# EAGLE design rapidshark-lipo-sensor-mk-3.2 (EAGLE 7.5.0)
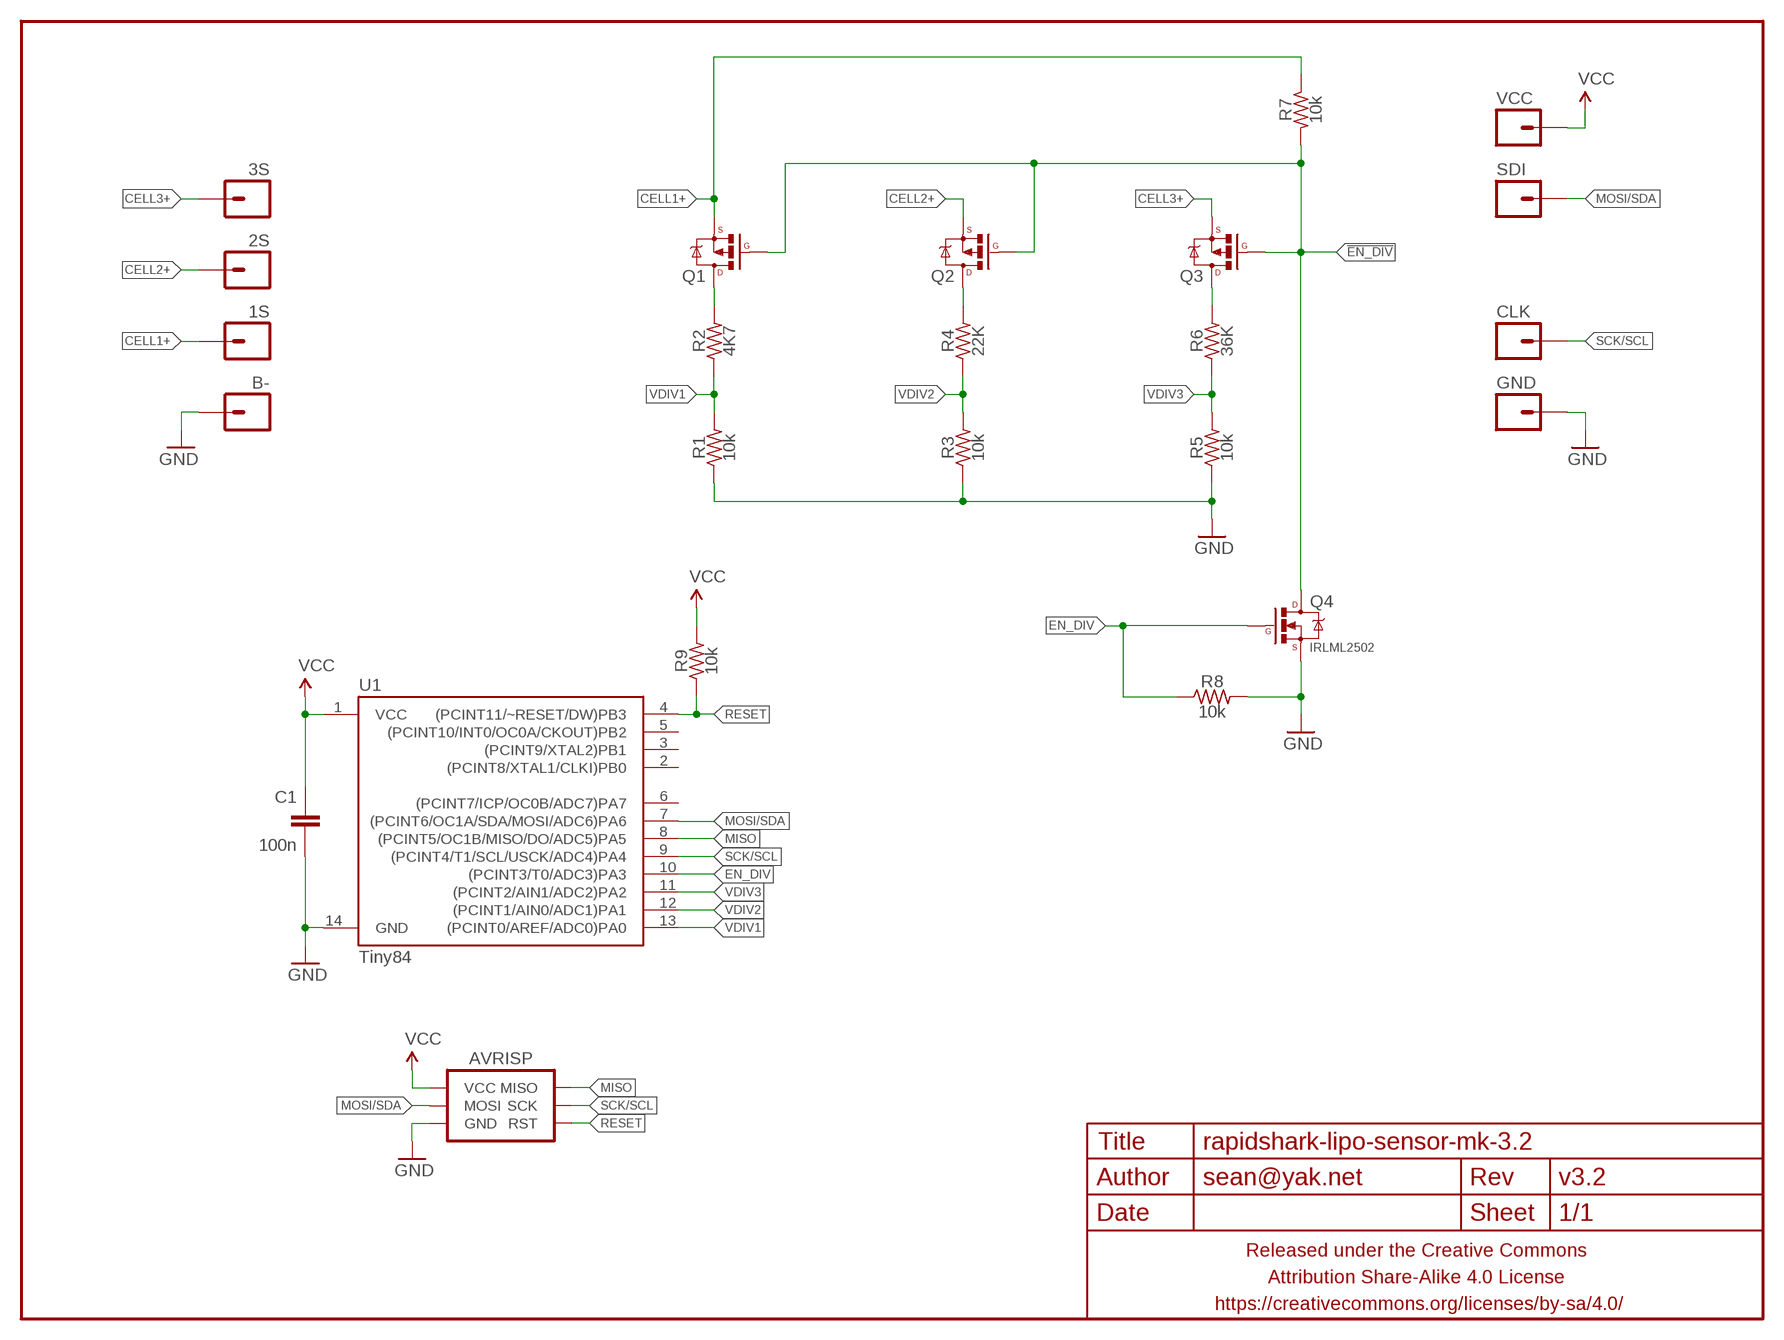
[diagram p0: schematic, sheet 1]

## Parts
1S  M01PTH-0.9MM  [1X01-0.9MM]
2S  M01PTH-0.9MM  [1X01-0.9MM]
3S  M01PTH-0.9MM  [1X01-0.9MM]
AVRISP  AVR_SPI_PRG_6SMD_TEST_POINTS  [2X3_SMD_TEST_POINTS]
B-  M01PTH-0.9MM  [1X01-0.9MM]
C1  100n  CAPACITOR-CERAMICC0603-TIGHTER  [C0603-TIGHTER]
CLK  M01PTH-0.9MM  [1X01-0.9MM]
FRAME1  FRAME-LETTERNO_PACKAGE  [DUMMY]
GND  M01PTH-0.9MM  [1X01-0.9MM]
Q1  MOSFET-PCHANNELSOT-23  [SOT23]
Q2  MOSFET-PCHANNELSOT-23  [SOT23]
Q3  MOSFET-PCHANNELSOT-23  [SOT23]
Q4  IRLML2502  MOSFET-NCHANNELIRLML2502  [SOT23]
R1  10k  RESISTORR0603-TIGHTER  [R0603-TIGHTER]
R2  4K7  RESISTORR0603-TIGHTER  [R0603-TIGHTER]
R3  10k  RESISTORR0603-TIGHTER  [R0603-TIGHTER]
R4  22K  RESISTORR0603-TIGHTER  [R0603-TIGHTER]
R5  10k  RESISTORR0603-TIGHTER  [R0603-TIGHTER]
R6  36K  RESISTORR0603-TIGHTER  [R0603-TIGHTER]
R7  10k  RESISTORR0603-TIGHTER  [R0603-TIGHTER]
R8  10k  RESISTORR0603-TIGHTER  [R0603-TIGHTER]
R9  10k  RESISTORR0603-TIGHTER  [R0603-TIGHTER]
SDI  M01PTH-0.9MM  [1X01-0.9MM]
U1  Tiny84  ATTINY84  [SO14]
VCC  M01PTH-0.9MM  [1X01-0.9MM]

## Nets
!EN_DIV: Q1.1(G) Q2.1(G) Q3.1(G) Q4.3(D) R7.2
CELL1+: 1S.1 Q1.2(S) R7.1
CELL2+: 2S.1 Q2.2(S)
CELL3+: 3S.1 Q3.2(S)
EN_DIV: Q4.1(G) R8.1 U1.10((PCINT3/T0/ADC3)PA3)
GND: AVRISP.6(GND) B-.1 C1.2 GND.1 Q4.2(S) R1.1 R3.1 R5.1 R8.2 U1.14(GND)
MISO: AVRISP.1(MISO) U1.8((PCINT5/OC1B/MISO/DO/ADC5)PA5)
MOSI/SDA: AVRISP.4(MOSI) SDI.1 U1.7((PCINT6/OC1A/SDA/MOSI/ADC6)PA6)
N$2: Q2.3(D) R4.2
N$3: Q3.3(D) R6.2
N$6: Q1.3(D) R2.2
RESET: AVRISP.5(RST) R9.1 U1.4((PCINT11/~RESET/DW)PB3)
SCK/SCL: AVRISP.3(SCK) CLK.1 U1.9((PCINT4/T1/SCL/USCK/ADC4)PA4)
VCC: AVRISP.2(VCC) C1.1 R9.2 U1.1(VCC) VCC.1
VDIV1: R1.2 R2.1 U1.13((PCINT0/AREF/ADC0)PA0)
VDIV2: R3.2 R4.1 U1.12((PCINT1/AIN0/ADC1)PA1)
VDIV3: R5.2 R6.1 U1.11((PCINT2/AIN1/ADC2)PA2)
Unconnected: U1.2((PCINT8/XTAL1/CLKI)PB0) U1.3((PCINT9/XTAL2)PB1) U1.5((PCINT10/INT0/OC0A/CKOUT)PB2) U1.6((PCINT7/ICP/OC0B/ADC7)PA7)

## Library data of the parts
1S 2S 3S B- CLK GND SDI VCC = a_parts:M01: Header 1 Standard 1-pin 0.1" header. Use with straight break away headers (SKU : PRT-00116), right angle break away headers (PRT-00553), swiss pins (PRT-00743), machine pins (PRT-00117), and female headers (PRT-00115).
AVRISP = A_butts:AVR_SPI_PRG_6: AVR ISP 6 Pin This is the reduced ISP connector for AVR programming. Common on Arduino. This footprint will take up less PCB space and can be used with a 10-pin to 6-pin adapter such as SKU: BOB-08508 **Special note about "TEST_POINT" package. The stop mask is on the top side, so if you want your programming test points to be on the bottom of your board, make sure to place this package on the bottom side of the board. This also ensure that the orientation to program from the bottom side will be correct.
C1 = a_parts:CAPACITOR-CERAMIC: CAPACITOR, European symbol
FRAME1 = A_butts:FRAME-LETTER: Schematic Frame Standard 8.5x11 US Letter frame; DESIGNER: sean@yak.net; VERSION: v3.2
Q1-Q3 = a_parts:MOSFET-PCHANNEL: Generic PMOSFET IRLML2244 - TRANS-11153 (SOT-23 -20V -4.3A) (1.Gate 2.Source 3.Drain) FQP27P06 - COM-10349 <http://www.sparkfun.com/products/10349> (TO-220 -60V -27A) (1.Gate 2.Source 3.Drain)
Q4 = a_parts:MOSFET-NCHANNEL: Common NMOSFET Parts MFG P/N Store ID Prod ID FDD8780 TRANS-09984 SI7820DN TRANS-11055 FDS6630A IC-08089 2N7002PW TRANS-11151 FQP30N06L COM-10213 TRANS-10060 BSS123LT1G TRANS-08345 BSS138 TRANS-00830 BS170 2N7000
R1-R9 = a_parts:RESISTOR: RESISTOR, American symbol
U1 = A_butts:ATTINY84: Atmel 14-pin 2/4/8kB flash uC

## Board
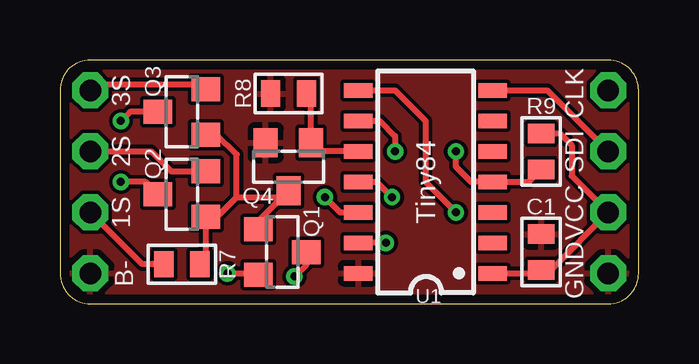
[diagram p1: board, top side]
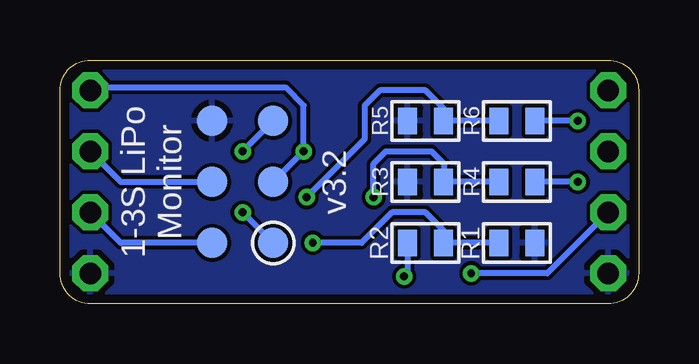
[diagram p2: board, bottom side, seen from below]

Size 24.13 x 10.16 mm. Coordinates in mm from the lower left corner, seen from the top.
Outline: 0,8.89 0,1.27 arc90 1.27,0 22.86,0 arc90 24.13,1.27 24.13,8.89 arc90 22.86,10.16 1.27,10.16 arc90 0,8.89
Copper layers (1*16): Top 0.0356mm / dielectric 1.5011mm / Bottom 0.0356mm
Design rules "LaenPCBOrder_2": minimum track width 6mil, minimum drill 13mil, track to track 6mil, track to pad 6mil, pad to pad 6mil, via to via 6mil, smd to smd 6mil, copper to edge 15mil, drill to drill 6mil, minimum pad ring 7mil, minimum via ring 7mil, stop-mask expansion 3mil, vias tented up to drill 20mil, thermal gap 10mil

### Footprints (pad centres in the part's own frame; a part is rotated, then mirrored left to right if it is on the bottom)
1X01-0.9MM = drill 0.9 pad 1.5 octagon: 1 0,0
2X3_SMD_TEST_POINTS = smd 1.27 x 1.27: 1 -2.54,-1.27; 2 -2.54,1.27; 3 0,-1.27; 4 0,1.27; 5 2.54,-1.27; 6 2.54,1.27
C0603-TIGHTER = smd 0.8 x 1.1: 1 -0.75,0; 2 0.75,0
SOT23 = smd 1 x 1.2: 1 -0.95,-1; 2 0.95,-1; 3 0,1
R0603-TIGHTER = smd 0.8 x 1.1: 1 -0.75,0; 2 0.75,0
SO14 = smd 0.6 x 1.2: 1 -3.81,-2.8; 2 -2.54,-2.8; 3 -1.27,-2.8; 4 0,-2.8; 5 1.27,-2.8; 6 2.54,-2.8; 7 3.81,-2.8; 8 3.81,2.8; 9 2.54,2.8; 10 1.27,2.8; 11 0,2.8; 12 -1.27,2.8; 13 -2.54,2.8; 14 -3.81,2.8

### Placement (x,y rotation side)
1S  1.27,3.81 270 top
2S  1.27,6.35 270 top
3S  1.27,8.89 270 top
AVRISP  16.51,5.08 90 bottom
B-  1.27,1.27 270 top
C1  20.07,2.16 90 top
CLK  22.86,8.89 90 top
FRAME1  0,0 0 top
GND  22.86,1.27 90 top
Q1  9.27,2.16 270 top
Q2  5.08,4.57 90 top
Q3  5.08,8 90 top
Q4  9.53,5.71 180 top
R1  5.08,2.54 180 bottom
R2  8.89,2.54 180 bottom
R3  8.89,5.08 0 bottom
R4  5.08,5.08 0 bottom
R5  8.89,7.62 0 bottom
R6  5.08,7.62 0 bottom
R7  5.08,1.65 0 top
R8  9.53,8.76 180 top
R9  20.07,6.35 90 top
SDI  22.86,6.35 90 top
U1  15.24,5.08 90 top
VCC  22.86,3.81 90 top

### Tracks (layer width: path | path; a pad name or v marks a point on that pad's centre or on a via)
!EN_DIV
  Top 0.254: 7.37,4.45 7.37,6.22 6.54,7.05 Q3.1 | 7.37,4.45 6.54,3.62 Q2.1 6.08,1.9 R7.2 | 7.37,4.45 9.26,4.45 Q4.3 8.27,3.46 Q1.1
CELL1+  (via drill 0.33)
  Top 0.254: v6.99,1.27 8.21,1.27 Q1.2 | R7.1 3.43,1.65 1S.1
  Bottom 0.254: 1S.1 3.81,1.27 v6.99,1.27
CELL2+
  Top 0.254: 2S.1 3.81,6.35 4.64,5.52 Q2.2
CELL3+
  Top 0.254: 3S.1 1.52,9.14 5.89,9.14 Q3.2
EN_DIV
  Top 0.254: R8.1 10.47,8.56 Q4.1 10.84,6.35 U1.10
GND
  pour Top: 1.27,10.16 22.86,10.16 arc-90 24.13,8.89 24.13,1.27 arc-90 22.86,0 1.27,0 arc-90 0,1.27 0,8.89 arc-90
  pour Bottom: 1.27,10.16 22.86,10.16 arc-90 24.13,8.89 24.13,1.27 arc-90 22.86,0 1.27,0 arc-90 0,1.27 0,8.89 arc-90
MISO  (via drill 0.33)
  Top 0.254: U1.8 13.97,8.89 15.24,7.62 15.24,5.08 v16.51,3.81
  Bottom 0.254: v16.51,3.81 AVRISP.1
MOSI/SDA
  Top 0.254: U1.7 20.32,8.89 SDI.1
  Bottom 0.254: SDI.1 21.59,5.08 AVRISP.4
N$2  (via drill 0.33)
  Top 0.254: Q2.3 3.57,5.08 v2.54,5.08
  Bottom 0.254: v2.54,5.08 R4.2
N$3  (via drill 0.33)
  Top 0.254: Q3.3 2.92,8 v2.54,7.62
  Bottom 0.254: v2.54,7.62 R6.2
N$6  (via drill 0.33)
  Top 0.254: Q1.3 10.27,1.64 v9.78,1.14
  Bottom 0.254: R2.2 9.64,1.28 v9.78,1.14
RESET  (via drill 0.33)
  Top 0.254: v16.51,6.35 16.51,5.71 17.14,5.08 U1.4 19.55,5.08 R9.1
  Bottom 0.254: v16.51,6.35 AVRISP.5
SCK/SCL  (via drill 0.33)
  Top 0.254: U1.9 13.34,7.62 13.97,6.99 v13.97,6.35
  Bottom 0.254: CLK.1 22.73,9.02 14.73,9.02 13.97,8.26 v13.97,6.35 AVRISP.3
VCC
  Top 0.254: U1.1 19.93,1.27 C1.1 20.46,1.41 VCC.1 21.34,5.33 21.34,6.6 20.84,7.1 R9.2
  Bottom 0.254: AVRISP.2 21.59,2.54 VCC.1
VDIV1  (via drill 0.33)
  Top 0.254: v13.59,2.54 U1.13
  Bottom 0.254: R1.2 R2.1 8.14,3.06 8.89,3.81 10.29,3.81 11.56,2.54 v13.59,2.54
VDIV2  (via drill 0.33)
  Top 0.254: v11.05,4.45 11.68,3.81 U1.12
  Bottom 0.254: R4.1 R3.2 8.13,5.09 8.13,5.84 8.64,6.35 10.54,6.35 11.05,5.84 v11.05,4.45
VDIV3  (via drill 0.33)
  Top 0.254: U1.11 13.21,5.08 v13.84,4.45
  Bottom 0.254: R6.1 R5.2 8.14,8.14 8.89,8.89 10.79,8.89 11.43,8.26 11.43,6.86 v13.84,4.45

### Text on the board
bPlace: 1-3S LiPo / Monitor